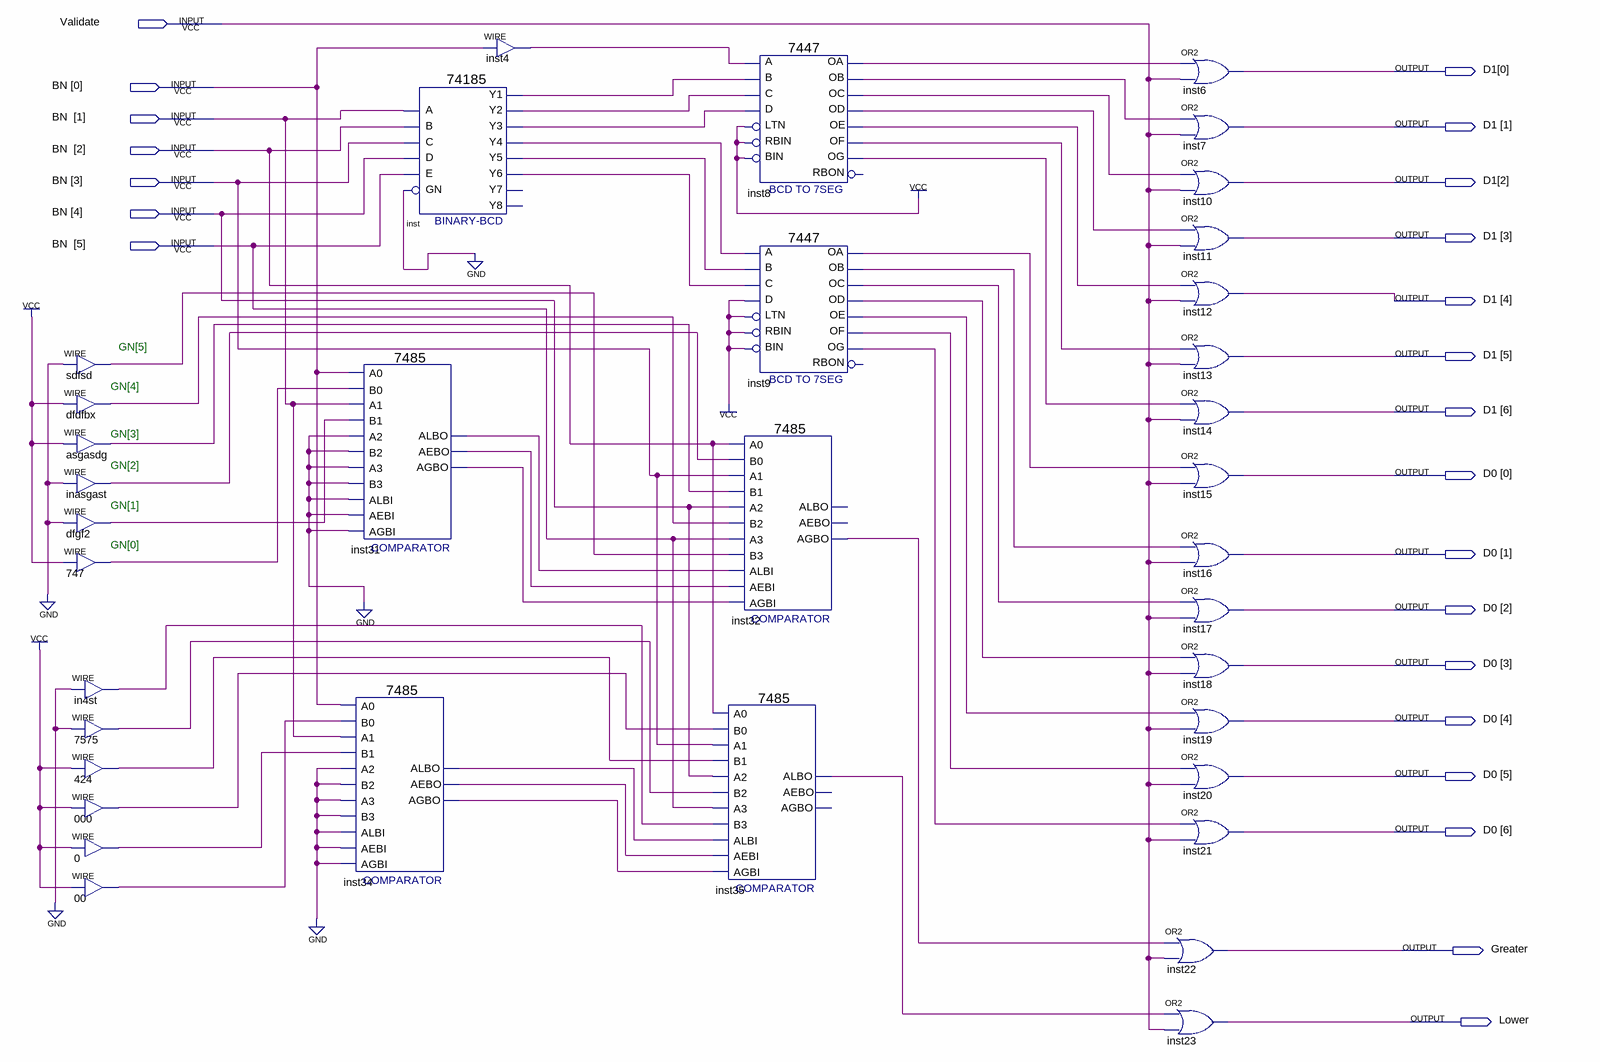
[diagram p0: schematic sheet]
// Quartus schematic SCH.bdf as structural Verilog: 36 symbols, 23 pins
module SCH (
  input  Validate,
  input  [5:0] BN,
  output [6:0] D1,
  output [6:0] D0,
  output Greater,
  output Lower
);

  wire asgasdg_out, dfdfbx_out, dfgf2_out, in4st_out, inasgast_out, inst4_out, inst8_oa, inst8_ob, inst8_oc,
       inst8_od, inst8_oe, inst8_of, inst8_og, inst9_oa, inst9_ob, inst9_oc, inst9_od, inst9_oe, inst9_of,
       inst9_og, inst31_aebo, inst31_agbo, inst31_albo, inst32_agbo, inst34_aebo, inst34_agbo, inst34_albo,
       inst35_albo, inst_y1, inst_y2, inst_y3, inst_y4, inst_y5, inst_y6, n00_out, n0_out, n000_out,
       n424_out, n747_out, n7575_out, sdfsd_out;

  assign sdfsd_out = 1'b0;  // WIRE sdfsd
  assign dfdfbx_out = 1'b1;  // WIRE dfdfbx
  assign asgasdg_out = 1'b1;  // WIRE asgasdg
  assign inasgast_out = 1'b0;  // WIRE inasgast
  assign dfgf2_out = 1'b0;  // WIRE dfgf2
  assign n747_out = 1'b1;  // WIRE 747
  assign in4st_out = 1'b0;  // WIRE in4st
  assign n7575_out = 1'b0;  // WIRE 7575
  assign n424_out = 1'b1;  // WIRE 424
  assign n000_out = 1'b1;  // WIRE 000
  assign n0_out = 1'b1;  // WIRE 0
  assign n00_out = 1'b1;  // WIRE 00
  \7485  inst31 (
    .A3(1'b0), .B2(1'b0), .A2(1'b0), .AEBI(1'b0), .AGBI(1'b0), .ALBI(1'b0), .A0(BN[0]), .B0(n747_out),
    .B3(1'b0), .A1(BN[1]), .B1(dfgf2_out), .ALBO(inst31_albo), .AGBO(inst31_agbo), .AEBO(inst31_aebo));
  \7485  inst34 (
    .A3(1'b0), .B2(1'b0), .A2(1'b0), .AEBI(1'b0), .AGBI(1'b0), .ALBI(1'b0), .A0(BN[0]), .B0(n00_out),
    .B3(1'b0), .A1(BN[1]), .B1(n0_out), .ALBO(inst34_albo), .AGBO(inst34_agbo), .AEBO(inst34_aebo));
  \74185  inst (
    .A(BN[1]), .B(BN[2]), .D(BN[4]), .C(BN[3]), .E(BN[5]), .GN(1'b0), .Y1(inst_y1), .Y3(inst_y3),
    .Y2(inst_y2), .Y5(inst_y5), .Y4(inst_y4), .Y6(inst_y6));  // open: Y8, Y7
  assign inst4_out = BN[0];  // WIRE inst4
  \7485  inst35 (
    .A3(BN[5]), .B2(n7575_out), .A2(BN[4]), .AEBI(inst34_aebo), .AGBI(inst34_agbo), .ALBI(inst34_albo),
    .A0(BN[2]), .B0(n000_out), .B3(in4st_out), .A1(BN[3]), .B1(n424_out), .ALBO(inst35_albo));  // open: AGBO, AEBO
  \7447  inst8 (
    .LTN(1'b1), .B(inst_y1), .C(inst_y2), .D(inst_y3), .RBIN(1'b1), .BIN(1'b1), .A(inst4_out), .OB(inst8_ob),
    .OC(inst8_oc), .OE(inst8_oe), .OD(inst8_od), .OF(inst8_of), .OG(inst8_og), .OA(inst8_oa));  // open: RBON
  \7447  inst9 (
    .LTN(1'b1), .B(inst_y5), .C(inst_y6), .D(1'b1), .RBIN(1'b1), .BIN(1'b1), .A(inst_y4), .OB(inst9_ob),
    .OC(inst9_oc), .OE(inst9_oe), .OD(inst9_od), .OF(inst9_of), .OG(inst9_og), .OA(inst9_oa));  // open: RBON
  \7485  inst32 (
    .A3(BN[5]), .B2(dfdfbx_out), .A2(BN[4]), .AEBI(inst31_aebo), .AGBI(inst31_agbo), .ALBI(inst31_albo),
    .A0(BN[2]), .B0(inasgast_out), .B3(sdfsd_out), .A1(BN[3]), .B1(asgasdg_out), .AGBO(inst32_agbo));  // open: ALBO, AEBO
  or inst6 (D1[0], inst8_oa, Validate);
  or inst7 (D1[1], inst8_ob, Validate);
  or inst10 (D1[2], inst8_oc, Validate);
  or inst11 (D1[3], inst8_od, Validate);
  or inst12 (D1[4], inst8_oe, Validate);
  or inst13 (D1[5], inst8_of, Validate);
  or inst14 (D1[6], inst8_og, Validate);
  or inst15 (D0[0], inst9_oa, Validate);
  or inst16 (D0[1], inst9_ob, Validate);
  or inst17 (D0[2], inst9_oc, Validate);
  or inst18 (D0[3], inst9_od, Validate);
  or inst19 (D0[4], inst9_oe, Validate);
  or inst20 (D0[5], inst9_of, Validate);
  or inst21 (D0[6], inst9_og, Validate);
  or inst22 (Greater, inst32_agbo, Validate);
  or inst23 (Lower, inst35_albo, Validate);

  // Notes on the sheet:
  //   GN[5]
  //   GN[4]
  //   GN[3]
  //   GN[2]
  //   GN[1]
  //   GN[0]
endmodule
